# EAGLE design ControllerBoard (EAGLE 6.1)
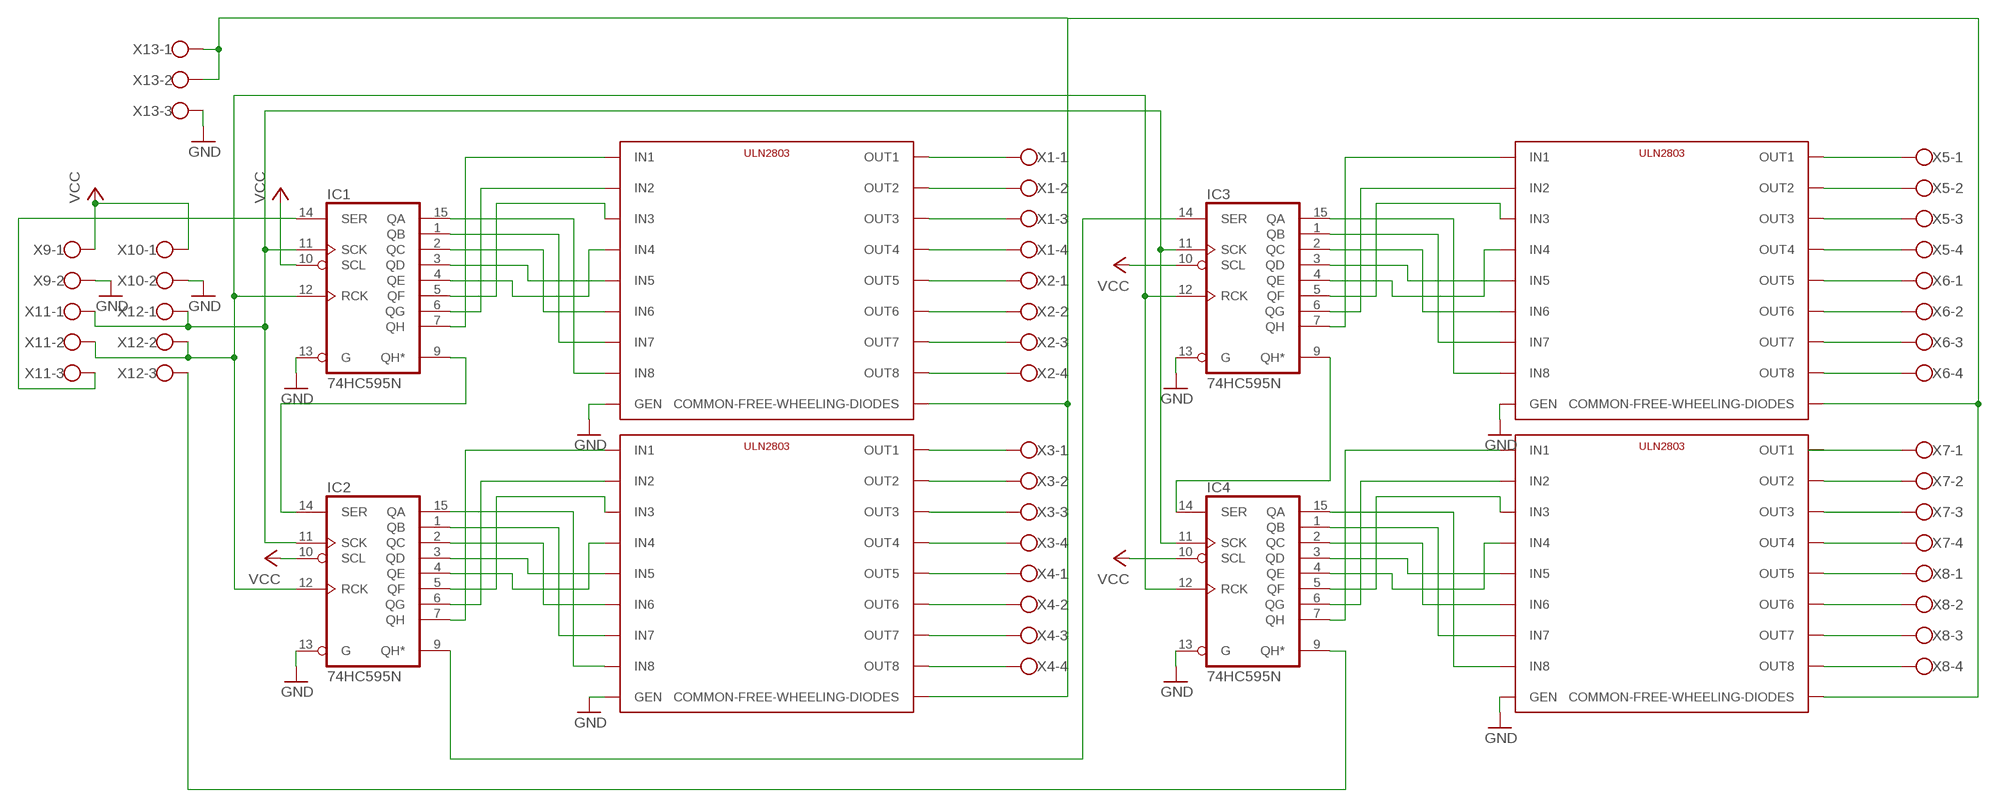
[diagram p0: schematic, sheet 1]

## Parts
IC1  74HC595N  [DIL16]
IC2  74HC595N  [DIL16]
IC3  74HC595N  [DIL16]
IC4  74HC595N  [DIL16]
U$1  ULN2803  [P-DIP]
U$2  ULN2803  [P-DIP]
U$3  ULN2803  [P-DIP]
U$4  ULN2803  [P-DIP]
X1  W237-4  [W237-4]
X2  W237-4  [W237-4]
X3  W237-4  [W237-4]
X4  W237-4  [W237-4]
X5  W237-4  [W237-4]
X6  W237-4  [W237-4]
X7  W237-4  [W237-4]
X8  W237-4  [W237-4]
X9  W237-102  [W237-102]
X10  W237-102  [W237-102]
X11  W237-103  [W237-103]
X12  W237-103  [W237-103]
X13  W237-103  [W237-103]

## Nets
GND: IC1.13(G) IC2.13(G) IC3.13(G) IC4.13(G) U$1.GEN U$2.GEN U$3.GEN U$4.GEN X9.2 X10.2 X13.3
N$1: IC1.9(QH*) IC2.14(SER)
N$2: IC2.7(QH) U$3.IN1
N$4: IC1.15(QA) U$1.IN8
N$5: IC1.1(QB) U$1.IN7
N$6: IC1.2(QC) U$1.IN6
N$7: IC1.3(QD) U$1.IN5
N$8: IC1.4(QE) U$1.IN4
N$9: IC1.5(QF) U$1.IN3
N$10: IC1.6(QG) U$1.IN2
N$11: IC1.7(QH) U$1.IN1
N$12: IC2.6(QG) U$3.IN2
N$13: IC2.5(QF) U$3.IN3
N$14: IC2.15(QA) U$3.IN8
N$15: IC2.1(QB) U$3.IN7
N$16: IC2.2(QC) U$3.IN6
N$17: IC2.4(QE) U$3.IN4
N$18: IC2.3(QD) U$3.IN5
N$19: IC1.14(SER) X11.3
N$21: U$1.OUT1 X1.1
N$22: U$1.OUT2 X1.2
N$23: U$1.OUT3 X1.3
N$24: U$1.OUT4 X1.4
N$25: U$1.OUT5 X2.1
N$26: U$1.OUT6 X2.2
N$27: U$1.OUT7 X2.3
N$28: U$1.OUT8 X2.4
N$29: U$3.OUT1 X3.1
N$30: U$3.OUT2 X3.2
N$31: U$3.OUT3 X3.3
N$32: U$3.OUT4 X3.4
N$33: U$3.OUT5 X4.1
N$34: U$3.OUT6 X4.2
N$35: U$3.OUT7 X4.3
N$36: U$3.OUT8 X4.4
N$37: IC3.7(QH) U$2.IN1
N$38: IC3.6(QG) U$2.IN2
N$39: IC3.5(QF) U$2.IN3
N$40: IC3.4(QE) U$2.IN4
N$41: IC3.3(QD) U$2.IN5
N$42: IC3.2(QC) U$2.IN6
N$43: IC3.1(QB) U$2.IN7
N$44: IC3.15(QA) U$2.IN8
N$45: U$4.OUT1 X7.1
N$46: U$2.OUT1 X5.1
N$47: U$2.OUT2 X5.2
N$48: U$2.OUT3 X5.3
N$49: U$2.OUT4 X5.4
N$50: U$2.OUT5 X6.1
N$51: U$2.OUT6 X6.2
N$52: U$2.OUT7 X6.3
N$53: IC4.7(QH) U$4.IN1
N$54: IC4.6(QG) U$4.IN2
N$55: IC4.5(QF) U$4.IN3
N$56: IC4.4(QE) U$4.IN4
N$57: IC4.3(QD) U$4.IN5
N$58: IC4.2(QC) U$4.IN6
N$59: IC4.1(QB) U$4.IN7
N$60: IC4.15(QA) U$4.IN8
N$61: U$2.OUT8 X6.4
N$62: U$4.OUT2 X7.2
N$63: U$4.OUT3 X7.3
N$64: U$4.OUT4 X7.4
N$65: U$4.OUT5 X8.1
N$66: U$4.OUT6 X8.2
N$67: U$4.OUT7 X8.3
N$68: U$4.OUT8 X8.4
N$69: IC2.9(QH*) IC3.14(SER)
N$70: IC3.9(QH*) IC4.14(SER)
N$71: U$1.COMMON-FREE-WHEELING-DIODES U$2.COMMON-FREE-WHEELING-DIODES U$3.COMMON-FREE-WHEELING-DIODES U$4.COMMON-FREE-WHEELING-DIODES X13.1 X13.2
N$72: IC4.9(QH*) X12.3
N$89: IC1.11(SCK) IC2.11(SCK) IC3.11(SCK) IC4.11(SCK) X11.1 X12.1
N$90: IC1.12(RCK) IC2.12(RCK) IC3.12(RCK) IC4.12(RCK) X11.2 X12.2
VCC: IC1.10(SCL) IC2.10(SCL) IC3.10(SCL) IC4.10(SCL) X9.1 X10.1

## Power pins joined to a net without a drawn wire
GND: IC1.8(GND) IC2.8(GND) IC3.8(GND) IC4.8(GND)
VCC: IC1.16(VCC) IC2.16(VCC) IC3.16(VCC) IC4.16(VCC)

## Library data of the parts
IC1-IC4 = 74xx-eu:74*595: 8-bit SHIFT REGISTER, output latch
U$1-U$4 = ULN2803:ULN2803
X1-X8 = con-wago-500:W237-4: WAGO SCREW CLAMP; OC_FARNELL: unknown; OC_NEWARK: unknown
X9 X10 = con-wago-500:W237-102: WAGO SCREW CLAMP; MPN: 237-102; OC_FARNELL: unknown; OC_NEWARK: 70K9898
X11-X13 = con-wago-500:W237-103: WAGO SCREW CLAMP; MPN: 237-103; OC_FARNELL: unknown; OC_NEWARK: 18M7116

## Board
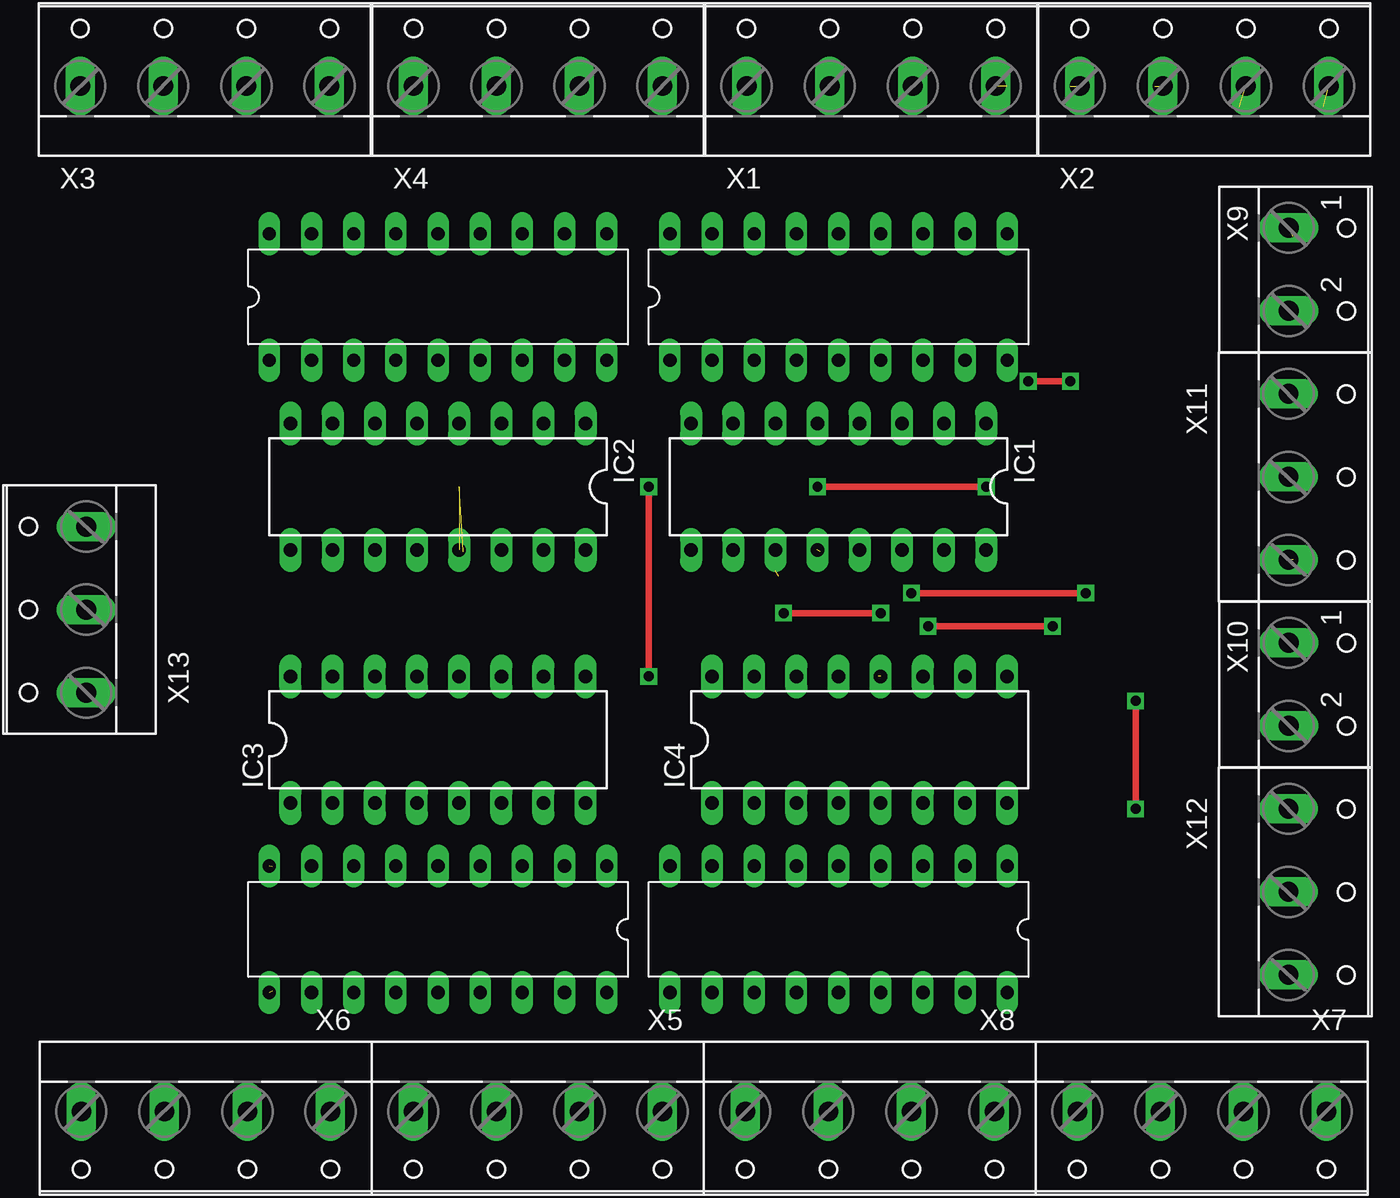
[diagram p1: board, top side]
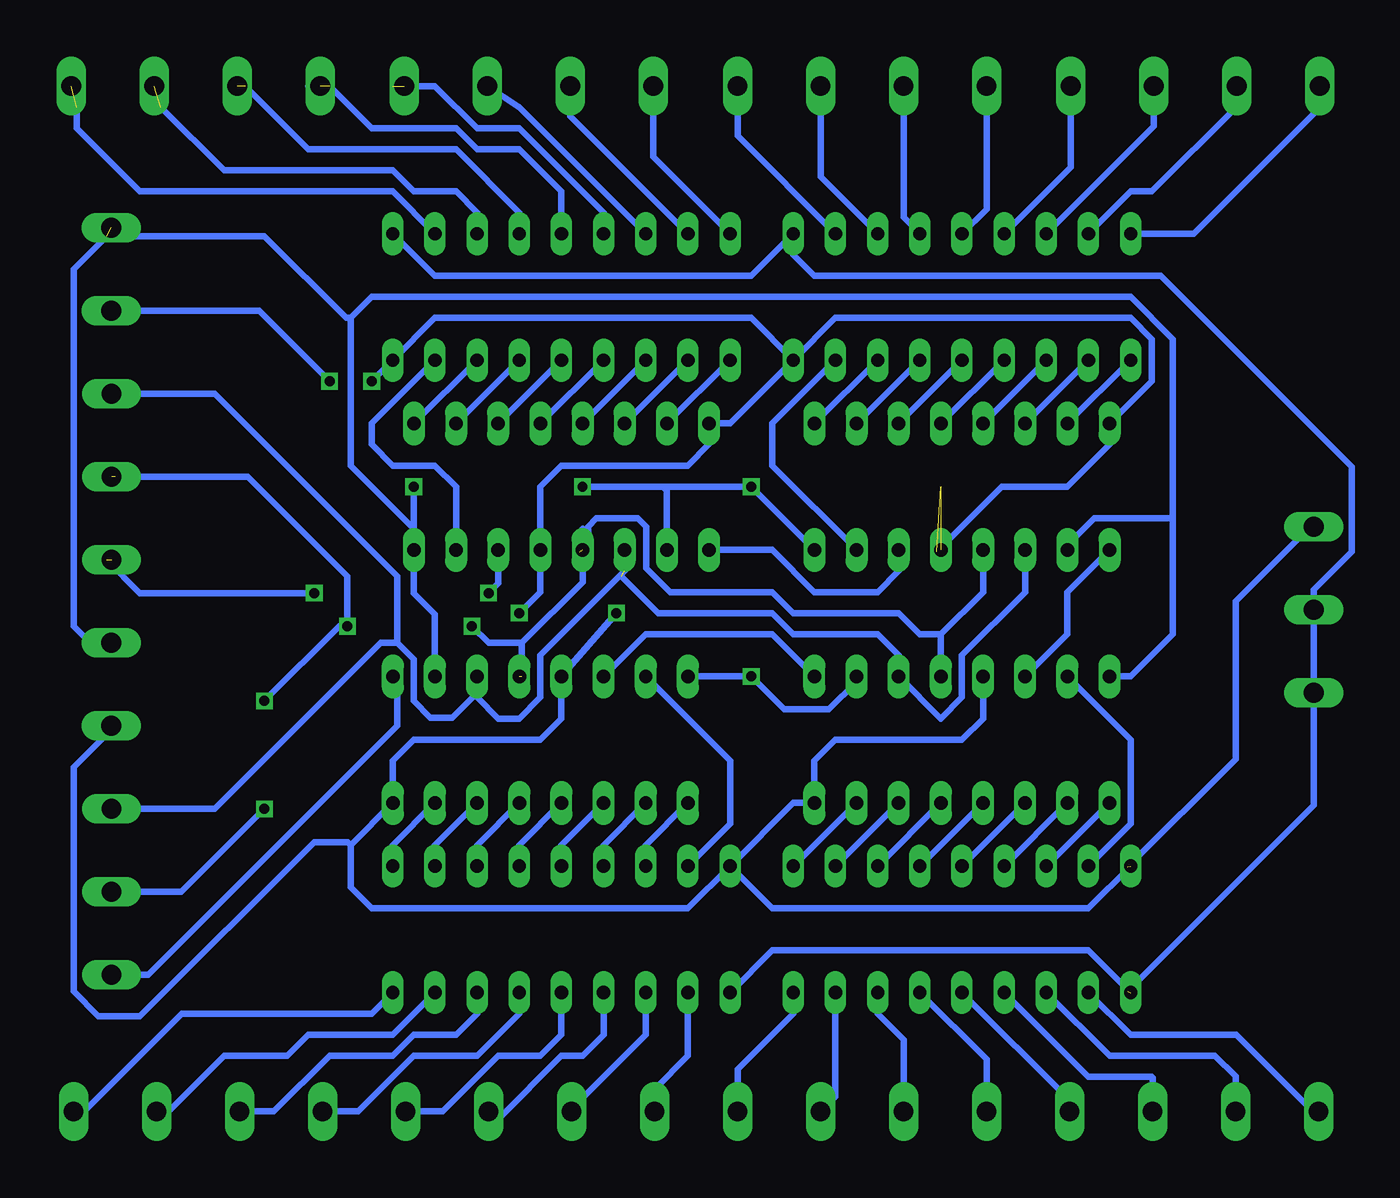
[diagram p2: board, bottom side, seen from below]

No outline drawn. Coordinates in mm, seen from the top.
Copper layers (1*16): Top 0.035mm / dielectric 1.5mm / Bottom 0.035mm
Design rules: minimum track width 10mil, minimum drill 24mil, track to track 8mil, track to pad 8mil, pad to pad 8mil, via to via 8mil, smd to smd 8mil, copper to edge 40mil, drill to drill 8mil, minimum pad ring 10mil, minimum via ring 8mil, stop-mask expansion 4mil, vias tented up to drill 0mil, thermal gap 10mil

### Footprints (pad centres in the part's own frame; a part is rotated, then mirrored left to right if it is on the bottom)
DIL16 = drill 0.813 long: 1 -8.89,-3.81; 2 -6.35,-3.81; 3 -3.81,-3.81; 4 -1.27,-3.81; 5 1.27,-3.81; 6 3.81,-3.81; 7 6.35,-3.81; 8 8.89,-3.81; 9 8.89,3.81; 10 6.35,3.81; 11 3.81,3.81; 12 1.27,3.81; 13 -1.27,3.81; 14 -3.81,3.81; 15 -6.35,3.81; 16 -8.89,3.81
P-DIP = drill 0.8 long: COMMON-FREE-WHEELING-DIODES 3.81,-10.16; GEN -3.81,-10.16; IN1 -3.81,10.16; IN2 -3.81,7.62; IN3 -3.81,5.08; IN4 -3.81,2.54; IN5 -3.81,0; IN6 -3.81,-2.54; IN7 -3.81,-5.08; IN8 -3.81,-7.62; OUT1 3.81,10.16; OUT2 3.81,7.62; OUT3 3.81,5.08; OUT4 3.81,2.54; OUT5 3.81,0; OUT6 3.81,-2.54; OUT7 3.81,-5.08; OUT8 3.81,-7.62
W237-4 = drill 1.194 long: 1 -7.5,-1.27; 2 -2.5,-1.27; 3 2.5,-1.27; 4 7.5,-1.27
W237-102 = drill 1.194 long: 1 -2.5,-1.27; 2 2.5,-1.27
W237-103 = drill 1.194 long: 1 -5,-1.29; 2 0,-1.29; 3 5,-1.29

### Placement (x,y rotation side)
IC1  54.61,41.91 180 top
IC2  30.48,41.91 180 top
IC3  30.48,26.67 0 top
IC4  55.88,26.67 0 top
U$1  54.61,53.34 90 top
U$2  30.48,15.24 270 top
U$3  30.48,53.34 90 top
U$4  54.61,15.24 270 top
X1  56.57,67.31 0 top
X2  76.64,67.31 0 top
X3  16.43,67.31 0 top
X4  36.5,67.31 0 top
X5  36.5,3 180 top
X6  16.5,3 180 top
X7  76.5,3 180 top
X8  56.5,3 180 top
X9  83,55 270 top
X10  83,30 270 top
X11  83,42.5 270 top
X12  83,17.5 270 top
X13  8,34.5 90 top

### Tracks (layer width: path | path; a pad name or v marks a point on that pad's centre or on a via)
GND  (via drill 0.6)  (3 unrouted)
  Top 0.406: v57.15,34.29 v51.3,34.29 | v66.04,48.26 v68.58,48.26
  Bottom 0.406: U$3.GEN 43.18,52.07 62.23,52.07 U$1.GEN v66.04,48.26 | U$4.GEN 41.91,16.51 22.86,16.51 U$2.GEN | U$3.GEN 38.1,52.07 20.32,52.07 19.05,50.8 19.05,48.26 IC2.8 21.59,44.45 24.13,41.91 28.09,41.91 32,38 | U$3.GEN 44.45,45.72 IC1.8 45.72,44.45 46.99,43.18 54.61,43.18 55.88,41.91 IC1.13 55.88,35.56 v57.15,34.29 | IC3.13 29.21,27.94 30.48,26.67 38.1,26.67 39.37,25.4 IC3.8 40.64,22.86 U$4.GEN | 67.31,20.32 IC4.8 64.77,25.4 63.5,26.67 55.88,26.67 54.61,27.94 IC4.13 v51.3,34.29 | 67.31,20.32 67.31,17.78 66.04,16.51 46.99,16.51 U$4.GEN | X9.2 72.82,52.5 v68.58,48.26 | X10.2 81.73,27.27 84,25 84,11.5 82.5,10 80,10 69.5,20.5 67.49,20.5 67.31,20.32 | X13.3 9.5,39.5 14,35 14,25.5 20.5,19 20,19
N$1
  Bottom 0.406: IC2.14 34.29,36.83 35.56,35.56 39.37,35.56 41.91,38.1 IC1.9
N$2
  Bottom 0.406: U$3.IN1 IC2.7
N$4
  Bottom 0.406: U$1.IN8 66.04,45.72 66.04,44.45 64.77,43.18 62.23,43.18 60.96,41.91 IC1.15
N$5
  Bottom 0.406: U$1.IN7 IC1.1
N$6
  Bottom 0.406: U$1.IN6 IC1.2
N$7
  Bottom 0.406: U$1.IN5 IC1.3
N$8
  Bottom 0.406: U$1.IN4 IC1.4
N$9
  Bottom 0.406: U$1.IN3 IC1.5
N$10
  Bottom 0.406: U$1.IN2 IC1.6
N$11
  Bottom 0.406: U$1.IN1 IC1.7
N$12
  Bottom 0.406: U$3.IN2 IC2.6
N$13
  Bottom 0.406: U$3.IN3 IC2.5
N$14
  Bottom 0.406: U$3.IN8 41.91,45.72 41.91,43.18 IC2.15
N$15
  Bottom 0.406: U$3.IN7 IC2.1
N$16
  Bottom 0.406: U$3.IN6 IC2.2
N$17
  Bottom 0.406: U$3.IN4 IC2.4
N$18
  Bottom 0.406: U$3.IN5 IC2.3
N$19  (via drill 0.6)  (1 unrouted)
  Top 0.406: v59,35.5 v69.5,35.5
  Bottom 0.406: IC1.14 58.42,36.08 v59,35.5 | v69.5,35.5 80,35.5 82,37.5
N$21
  Bottom 0.406: X1.1 49.07,61.77 U$1.OUT1
N$22
  Bottom 0.406: X1.2 54.07,64.23 U$1.OUT2
N$23
  Bottom 0.406: X1.3 57.15,64.77 U$1.OUT3
N$24  (1 unrouted)
  Bottom 0.406: U$1.OUT4 52.07,58.42 57.15,63.5 59.69,63.5 62.23,66.04 64.77,66.04
N$25  (1 unrouted)
  Bottom 0.406: U$1.OUT5 54.61,59.69 57.15,62.23 59.69,62.23 60.96,63.5 66.04,63.5 68.58,66.04 69.85,66.04
N$26  (1 unrouted)
  Bottom 0.406: 73.66,66.04 69.85,62.23 60.96,62.23 57.15,58.42 U$1.OUT6
N$27  (1 unrouted)
  Bottom 0.406: 78.74,64.77 74.93,60.96 64.77,60.96 63.5,59.69 60.96,59.69 59.69,58.42 U$1.OUT7
N$28  (1 unrouted)
  Bottom 0.406: U$1.OUT8 64.77,59.69 80.01,59.69 83.82,63.5 83.82,64.77
N$29
  Bottom 0.406: X3.1 8.93,64.73 16.51,57.15 U$3.OUT1
N$30
  Bottom 0.406: X3.2 13.97,64.77 19.05,59.69 20.32,59.69 U$3.OUT2
N$31
  Bottom 0.406: X3.3 18.93,63.62 U$3.OUT3
N$32
  Bottom 0.406: X3.4 23.93,61.16 U$3.OUT4
N$33
  Bottom 0.406: X4.1 29,58.63 U$3.OUT5
N$34
  Bottom 0.406: X4.2 34,58.13 U$3.OUT6
N$35
  Bottom 0.406: X4.3 39,60.59 U$3.OUT7
N$36
  Bottom 0.406: X4.4 44,63.05 U$3.OUT8
N$37
  Bottom 0.406: IC3.7 U$2.IN1
N$38
  Bottom 0.406: IC3.6 U$2.IN2
N$39
  Bottom 0.406: IC3.5 U$2.IN3
N$40
  Bottom 0.406: IC3.4 U$2.IN4
N$41
  Bottom 0.406: IC3.3 U$2.IN5
N$42
  Bottom 0.406: IC3.2 U$2.IN6
N$43
  Bottom 0.406: IC3.1 U$2.IN7
N$44
  Bottom 0.406: U$2.IN8 20.32,21.59 20.32,26.67 IC3.15
N$45
  Bottom 0.406: X7.1 83.36,4.27 77.47,10.16 66.04,10.16 U$4.OUT1
N$46
  Bottom 0.406: X5.1 44,6.8 40.64,10.16 U$2.OUT1
N$47
  Bottom 0.406: U$2.OUT2 38.1,5.17 X5.2
N$48
  Bottom 0.406: X5.3 34,8.6 35.56,10.16 U$2.OUT3
N$49
  Bottom 0.406: X5.4 29,7.41 U$2.OUT4
N$50
  Bottom 0.406: X6.1 24,4.95 U$2.OUT5
N$51
  Bottom 0.406: X6.2 19,6.3 19.05,6.35 22.86,6.35 U$2.OUT6
N$52
  Bottom 0.406: X6.3 14,6.38 15.24,7.62 21.59,7.62 U$2.OUT7
N$53
  Bottom 0.406: U$4.IN1 64.77,20.32 IC4.7
N$54
  Bottom 0.406: U$4.IN2 62.23,20.32 IC4.6
N$55
  Bottom 0.406: U$4.IN3 59.69,20.32 IC4.5
N$56
  Bottom 0.406: U$4.IN4 57.15,20.32 IC4.4
N$57
  Bottom 0.406: U$4.IN5 54.61,20.32 IC4.3
N$58
  Bottom 0.406: U$4.IN6 52.07,20.32 IC4.2
N$59
  Bottom 0.406: U$4.IN7 49.53,20.32 IC4.1
N$60
  Bottom 0.406: U$4.IN8 44.45,21.59 44.45,25.4 IC4.15
N$61
  Bottom 0.406: X6.4 9.35,4.27 13.97,8.89 20.32,8.89 U$2.OUT8
N$62
  Bottom 0.406: X7.2 78.28,4.27 74.93,7.62 71.12,7.62 69.85,8.89 64.77,8.89 U$4.OUT2
N$63
  Bottom 0.406: X7.3 71.93,4.27 68.58,7.62 64.77,7.62 63.5,8.89 60.96,8.89 59.69,10.16 U$4.OUT3
N$64
  Bottom 0.406: X7.4 66.85,4.27 63.5,7.62 59.69,7.62 57.15,10.16 U$4.OUT4
N$65
  Bottom 0.406: X8.1 61.77,4.27 58.42,7.62 55.88,7.62 54.61,8.89 U$4.OUT5
N$66
  Bottom 0.406: U$4.OUT6 52.07,8.89 53.34,7.62 54.61,7.62 58.42,3.81 58.54,3.81 X8.2
N$67
  Bottom 0.406: X8.3 54,4.42 49.53,8.89 U$4.OUT7
N$68
  Bottom 0.406: X8.4 49,5.61 46.99,7.62 U$4.OUT8
N$69
  Bottom 0.406: IC3.14 24.13,33.02 24.13,35.56 IC2.9
N$70
  Bottom 0.406: IC3.9 41.91,33.02 49.53,33.02 IC4.14
N$71  (1 unrouted)
  Bottom 0.406: U$1.COMMON-FREE-WHEELING-DIODES 62.23,54.61 43.18,54.61 U$3.COMMON-FREE-WHEELING-DIODES 40.64,55.88 39.37,54.61 18.5,54.61 7,43.11 7,38 9.29,35.71 X13.2 X13.1 9.29,22.71 20.5,11.5 | U$4.COMMON-FREE-WHEELING-DIODES 41.91,13.97 22.86,13.97 U$2.COMMON-FREE-WHEELING-DIODES
N$72
  Bottom 0.406: X12.3 79.5,12.5 64.5,27.5 64.5,30.21 IC4.9
N$89  (1 unrouted)
  Bottom 0.406: IC4.11 59.69,29.5 | 59.69,29.5 59.69,29.21 58.42,27.94 57.15,27.94 55.88,29.21 55.88,31.75 50.8,36.83 IC1.11 | IC2.11 26.67,35.56 30.48,31.75 30.48,29.21 31.75,27.94 IC3.11 34.29,31.75 35.56,33.02 40.64,33.02 41.91,34.29 48.79,34.29 51,36.5 | X12.1 75.5,22.5 65.5,32.5 64.5,32.5 | 64.5,32.5 63.5,31.5 63.5,29 62.5,28 61.19,28 59.69,29.5 | X11.1 75.5,47.5 64.5,36.5 64.5,32.5
N$90  (via drill 0.6)  (3 unrouted)
  Top 0.406: v60,33.5 v67.5,33.5 | v72.5,22.5 v72.5,29
  Bottom 0.406: IC3.12 31.75,33.02 | 31.75,33.02 29.21,35.56 IC2.12 | 31.75,33.02 33.02,33.02 34.29,34.29 40.64,34.29 41.91,35.56 48.06,35.56 49.5,37 49.5,39.5 50,40 52.5,40 53,39.5 53,38.5 53.5,38 | 53.34,39.37 IC1.12 53.34,36.16 57,32.5 | 57,32.5 57,30.5 | 57,32.5 59,32.5 v60,33.5 | 81.5,42.5 73.5,42.5 67.5,36.5 v67.5,33.5 68,33.5 v72.5,29 | X12.2 77.5,17.5 v72.5,22.5
VCC  (via drill 0.6)  (1 unrouted)
  Top 0.406: v53.34,41.91 v63.5,41.91 | v43.18,41.91 v43.18,30.48
  Bottom 0.406: 48.5,41.91 v43.18,41.91 IC2.16 | 48.5,41.91 v53.34,41.91 | v63.5,41.91 63.5,39.37 | 63.5,39.37 IC1.16 63.5,35.5 62.23,34.23 IC4.10 | IC3.16 20.32,30.48 17.78,33.02 17.78,40 | 17.78,40 17.78,50.8 20.32,53.34 66.04,53.34 67.31,52.07 | 67.31,52.07 67.31,43.18 63.5,39.37 | IC4.16 v43.18,30.48 41.2,28.5 38.5,28.5 36.83,30.17 IC3.10 | 67.31,52.07 67.57,52.07 72.5,57 82,57 84,55 84,33.5 83,32.5 X10.1 | IC2.10 24.13,38.37 22.5,40 17.78,40 | IC1.10 48.26,41.67 48.5,41.91